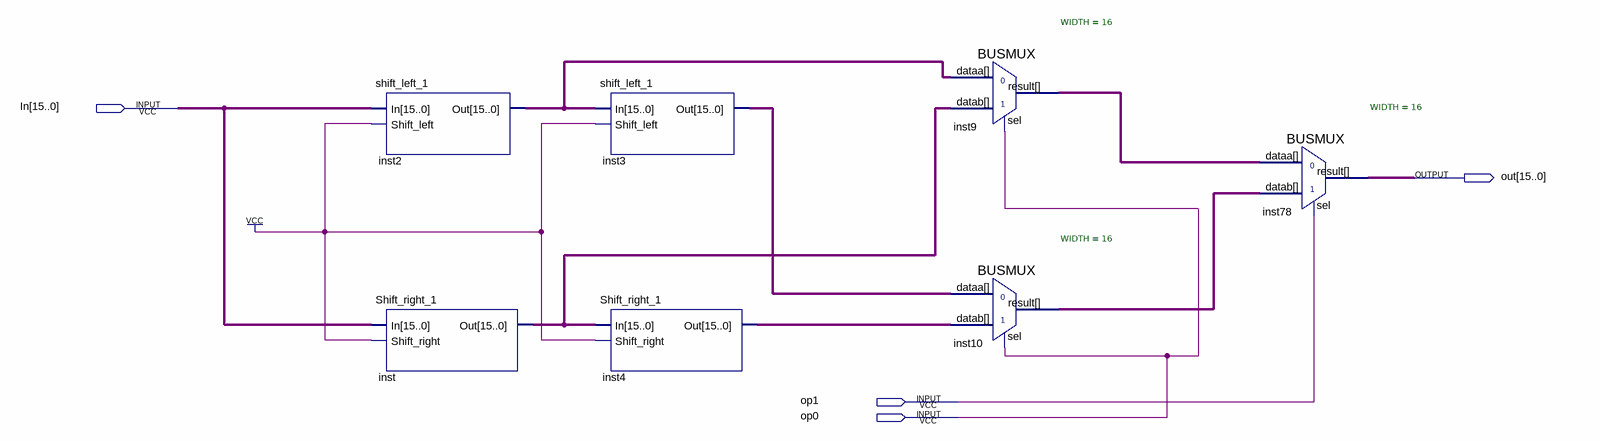
[diagram p0: schematic sheet]
// Quartus schematic Shift_1_2.bdf as structural Verilog: 7 symbols, 4 pins
module Shift_1_2 (
  input  [15:0] In,
  input  op1,
  input  op0,
  output [15:0] out
);

  wire [15:0] inst2_out, inst3_out, inst4_out, inst9_result, inst10_result, inst_out;

  shift_left_1 inst2 (.In(In), .Shift_left(1'b1), .Out(inst2_out));
  Shift_right_1 inst (.In(In), .Shift_right(1'b1), .Out(inst_out));
  shift_left_1 inst3 (.In(inst2_out), .Shift_left(1'b1), .Out(inst3_out));
  Shift_right_1 inst4 (.In(inst_out), .Shift_right(1'b1), .Out(inst4_out));
  BUSMUX #(.WIDTH(16)) inst9 (.datab(inst_out), .sel(op0), .dataa(inst2_out), .result(inst9_result));
  BUSMUX #(.WIDTH(16)) inst10 (.datab(inst4_out), .sel(op0), .dataa(inst3_out), .result(inst10_result));
  BUSMUX #(.WIDTH(16)) inst78 (.datab(inst10_result), .sel(op1), .dataa(inst9_result), .result(out));
endmodule
